# EAGLE design PlantSensorHead (EAGLE 8.0.2)
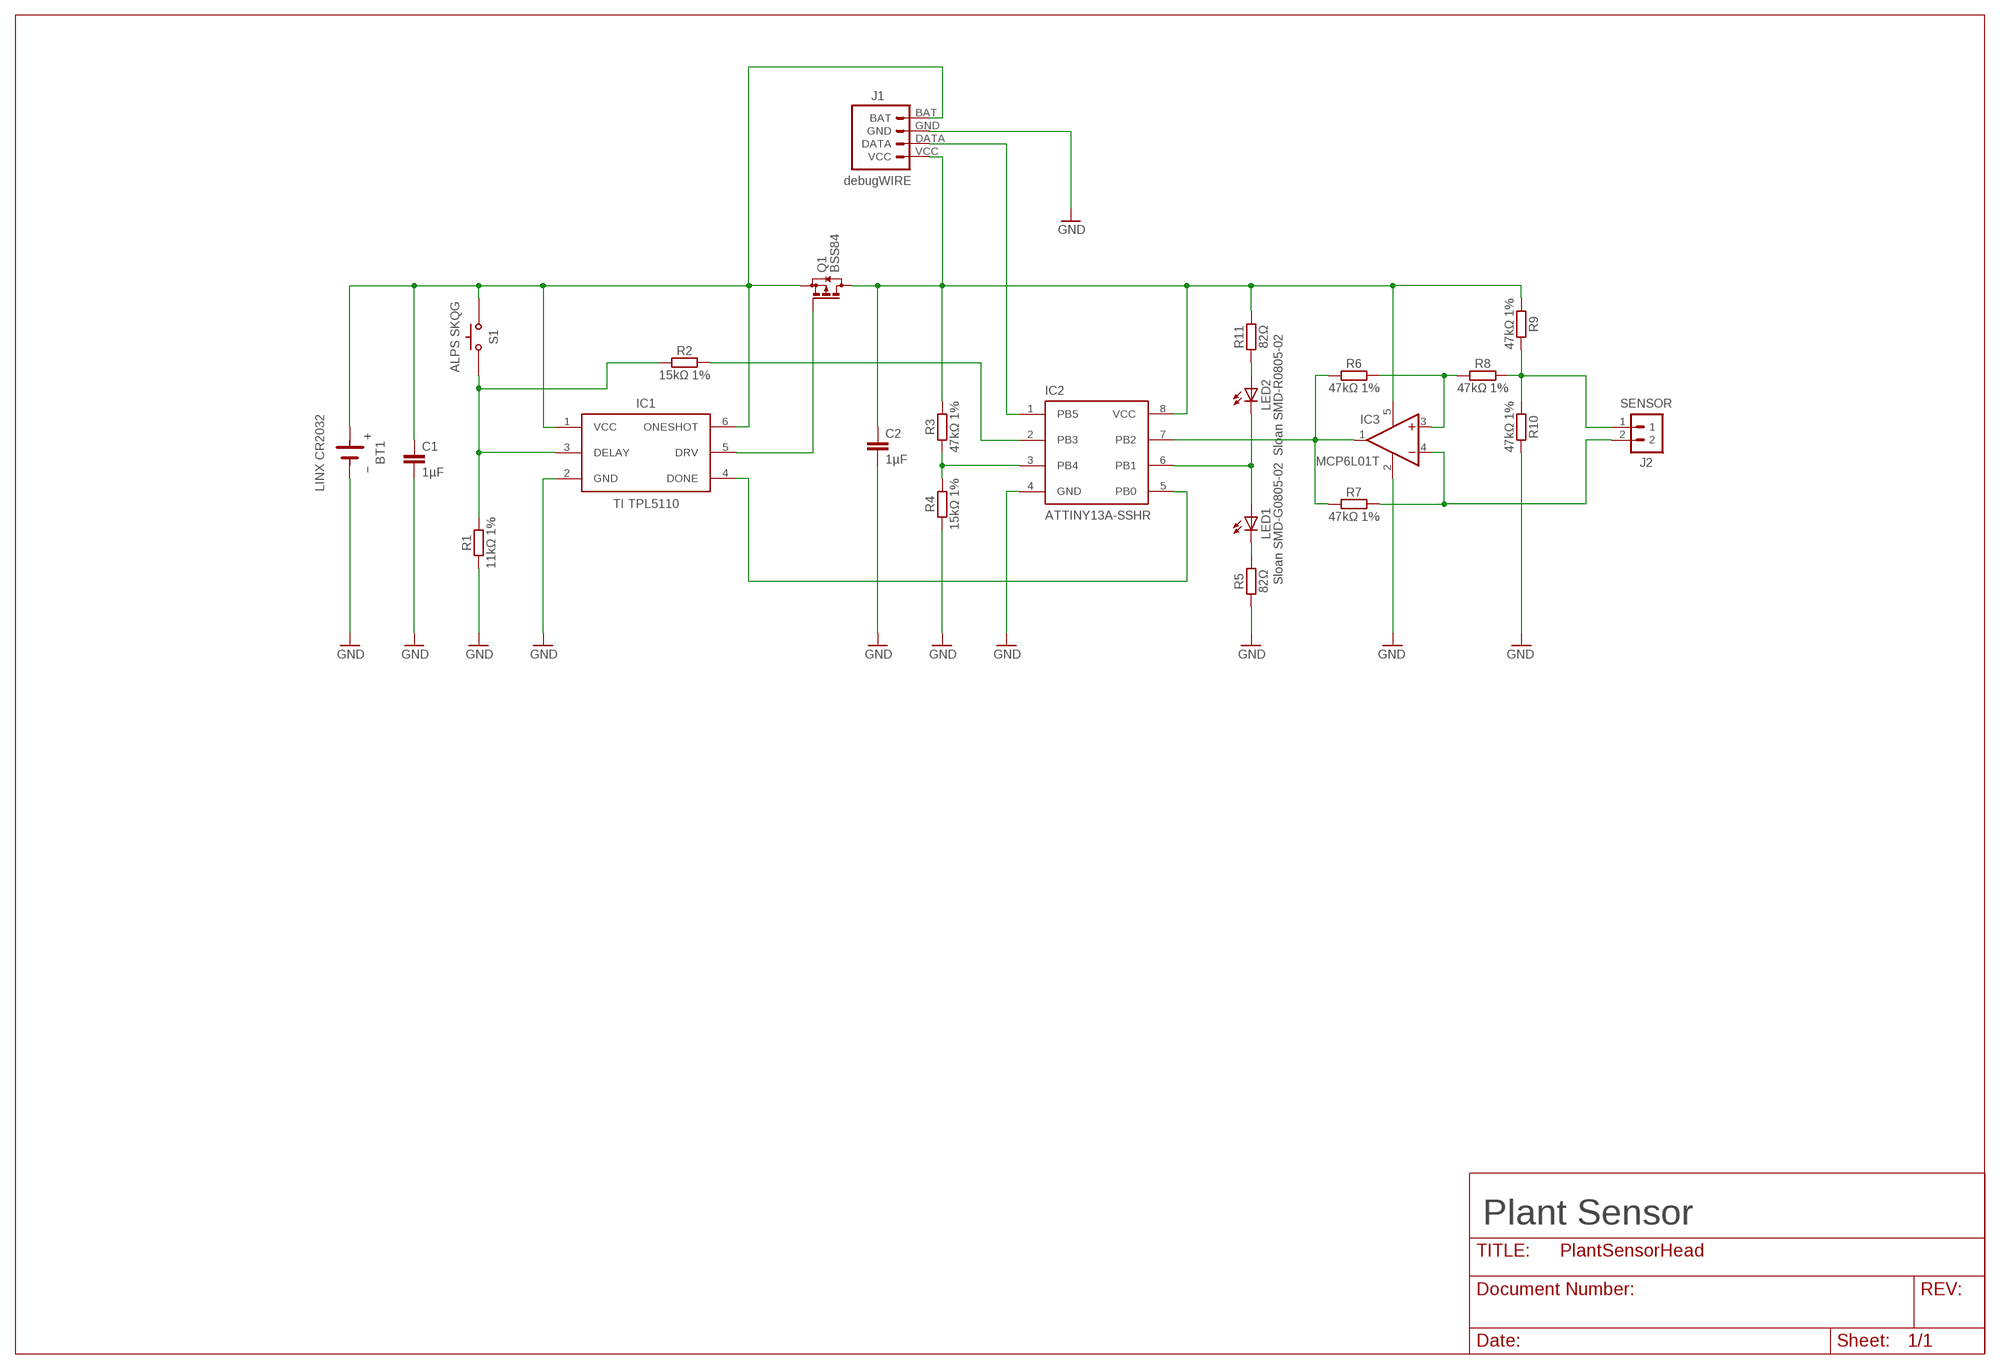
[diagram p0: schematic, sheet 1]

## Parts
BT1  LINX CR2032  LINX-CR2032-BATTERY-HOLDER  [LINX-BAT-HLD-001]
C1  1µF  C0805-MURATA-GRM-21  [CAPACITOR-0805-MURATA-GRM-21]
C2  1µF  C0805-MURATA-GRM-21  [CAPACITOR-0805-MURATA-GRM-21]
IC1  TI TPL5110  TPL5110SOT  [SOT23-6L]
IC2  ATTINY13A-SSHR  ATTINY13SO08  [SO08_015_JEDEC]
IC3  MCP6L01T  MCP601OT  [SOT23-5]
J1  debugWIRE  CON-DEBUGWIRE-SMD-50  [CON-PADS-DEBUG-WIRE-50]
J2  SENSOR  CON_2X1WIREPADS  [CON_PADS_2XWIRE]
LED1  Sloan SMD-G0805-02  LED0805-SLOAN  [LED-0805-SLOAN]
LED2  Sloan SMD-R0805-02  LED0805-SLOAN  [LED-0805-SLOAN]
Q1  BSS84  [SOT23]
R1  11kΩ 1%  RESISTOR0805-KOA-RK73-2A  [RESISTOR-0805-KOA-RK73-2A]
R2  15kΩ 1%  RESISTOR0805-KOA-RK73-2A  [RESISTOR-0805-KOA-RK73-2A]
R3  47kΩ 1%  RESISTOR0805-KOA-RK73-2A  [RESISTOR-0805-KOA-RK73-2A]
R4  15kΩ 1%  RESISTOR0805-KOA-RK73-2A  [RESISTOR-0805-KOA-RK73-2A]
R5  82Ω  RESISTOR0805-KOA-RK73-2A  [RESISTOR-0805-KOA-RK73-2A]
R6  47kΩ 1%  RESISTOR0805-KOA-RK73-2A  [RESISTOR-0805-KOA-RK73-2A]
R7  47kΩ 1%  RESISTOR0805-KOA-RK73-2A  [RESISTOR-0805-KOA-RK73-2A]
R8  47kΩ 1%  RESISTOR0805-KOA-RK73-2A  [RESISTOR-0805-KOA-RK73-2A]
R9  47kΩ 1%  RESISTOR0805-KOA-RK73-2A  [RESISTOR-0805-KOA-RK73-2A]
R10  47kΩ 1%  RESISTOR0805-KOA-RK73-2A  [RESISTOR-0805-KOA-RK73-2A]
R11  82Ω  RESISTOR0805-KOA-RK73-2A  [RESISTOR-0805-KOA-RK73-2A]
S1  ALPS SKQG  ALPS_SKQG_BUTTONAKE010  [ALPS_SKQGAKE010]

## Nets
BTN: IC1.3(DELAY) R1.2 R2.1 S1.1 S1.2
C_FREQ: IC2.7(PB2) IC3.1(OUT) R6.2 R7.2
DONE: IC1.4(DONE) IC2.5(PB0)
GND: BT1.GND C1.2 C2.2 IC1.2(GND) IC2.4(GND) IC3.2(V-) J1.GND R1.1 R4.1 R5.1 R10.1
LED: IC2.6(PB1) LED1.A LED2.C
N$1: LED2.A R11.1
N$2: LED1.C R5.2
N$3: IC1.5(DRV) Q1.1(G)
N$4: IC2.2(PB3) R2.2
N$10: IC3.3(+IN) R6.1 R8.2
RST: IC2.1(PB5) J1.DATA
SENS1A: J2.1 R8.1 R9.1 R10.2
SENS2A: IC3.4(-IN) J2.2 R7.1
VBR: IC2.3(PB4) R3.1 R4.2
VCCB: BT1.VDD1(VDD) BT1.VDD2(VDD) C1.1 IC1.1(VCC) IC1.6(ONESHOT) J1.BAT Q1.2(S) S1.3 S1.4
VCCM: C2.1 IC2.8(VCC) IC3.5(V+) J1.VCC Q1.3(D) R3.2 R9.2 R11.2

## Notes on the sheet
- Plant Sensor

## Library data of the parts
BT1 = lucky-resistor:LINX-CR2032-BATTERY-HOLDER
C1 C2 = lucky-resistor:C
IC1 = lucky-resistor:TPL5110
IC2 = lucky-resistor:ATTINY13
IC3 = linear:MCP601
J1 = lucky-resistor:CON-DEBUGWIRE
J2 = lucky-resistor:CON_2X1
LED1 LED2 = lucky-resistor:LED
Q1 = lucky-resistor:BSS84: P-CHANNEL MOS FET
R1-R11 = lucky-resistor:RESISTOR
S1 = lucky-resistor:ALPS_SKQG_BUTTON

## Net classes
0 default: clearance 0.205 mm

## Board
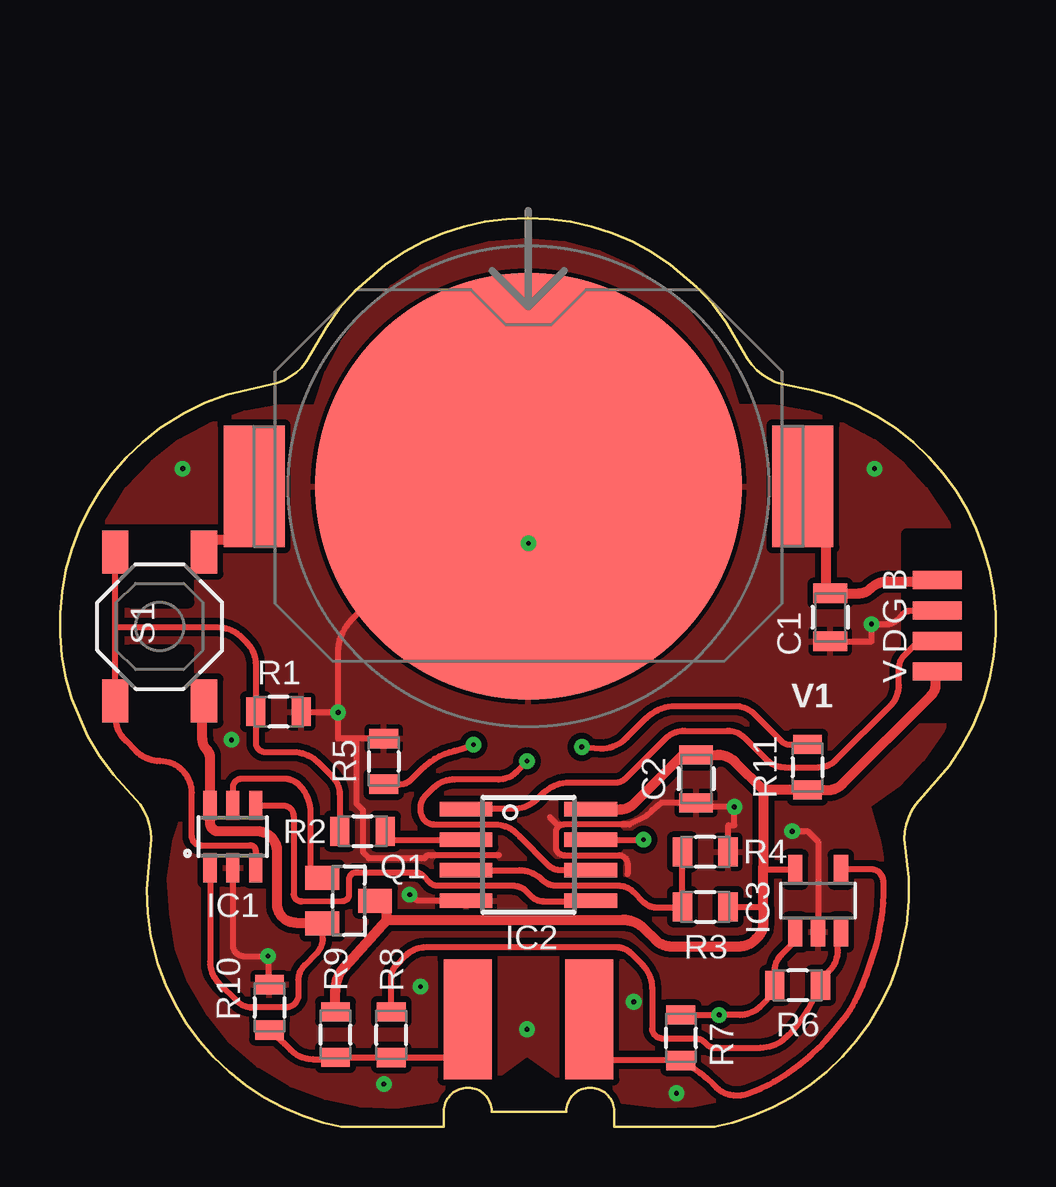
[diagram p1: board, top side]
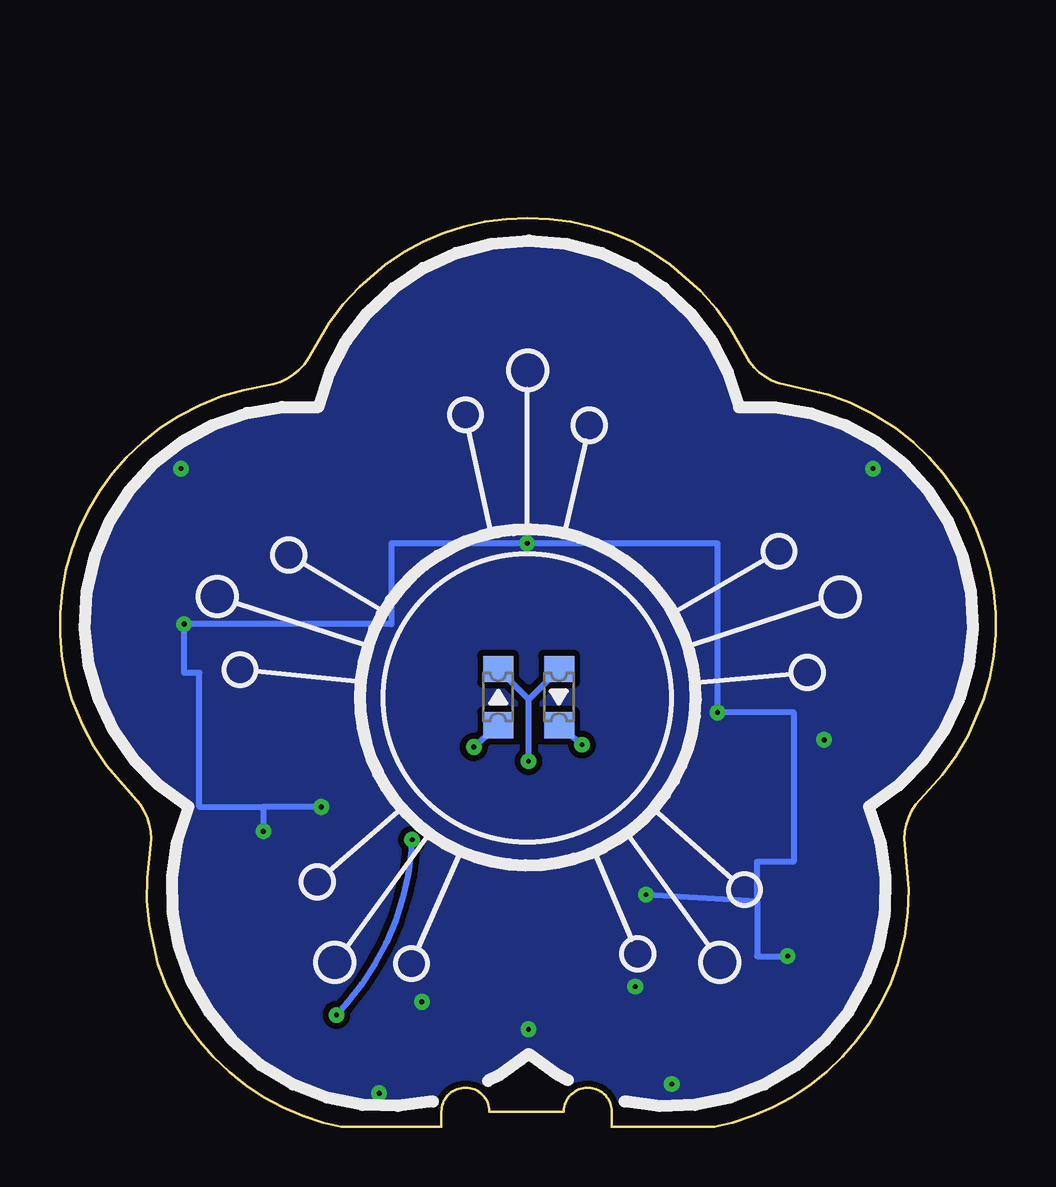
[diagram p2: board, bottom side, seen from below]

Size 38.98 x 37.88 mm. Coordinates in mm from the lower left corner, seen from the top.
Outline: 28.01,0.17 28.87,0.45 29.7,0.81 30.49,1.24 31.24,1.73 31.94,2.29 32.59,2.91 33.19,3.59 33.72,4.32 34.19,5.1 34.58,5.92 34.91,6.79 35.28,8.44 35.36,9.41 35.36,10.37 35.18,12.01 35.2,12.31 35.26,12.61 35.36,12.9 35.49,13.18 35.65,13.44 37.04,15.04 37.58,15.85 38.05,16.72 38.49,17.82 38.74,18.71 38.9,19.62 38.98,20.52 38.98,21.43 38.9,22.32 38.74,23.21 38.5,24.07 38.18,24.91 37.79,25.72 37.33,26.5 36.8,27.23 36.21,27.92 35.54,28.55 34.82,29.12 34.03,29.63 33.15,30.09 32.24,30.45 31.33,30.72 30.09,30.95 29.8,31.05 29.52,31.18 29.27,31.35 29.03,31.54 28.82,31.77 28.63,32.01 27.77,33.51 27.19,34.28 26.53,35.01 25.43,35.94 24.66,36.46 23.86,36.89 23.02,37.25 22.16,37.52 21.28,37.72 20.39,37.84 19.49,37.88 18.6,37.84 17.7,37.72 16.83,37.52 15.96,37.25 15.13,36.89 14.32,36.46 13.55,35.94 12.29,34.83 11.64,34.09 11.08,33.31 10.26,31.89 10.06,31.65 9.84,31.44 9.59,31.26 9.32,31.11 9.04,31 6.97,30.52 6.06,30.19 5.17,29.76 4.17,29.12 3.44,28.55 2.78,27.92 2.18,27.23 1.65,26.5 1.19,25.72 0.8,24.91 0.49,24.07 0.25,23.21 0.09,22.32 0,21.43 0,20.52 0.08,19.62 0.24,18.71 0.5,17.82 1.16,16.28 1.66,15.44 2.23,14.67 3.34,13.44 3.5,13.18 3.63,12.9 3.72,12.61 3.78,12.31 3.8,12.01 3.61,9.89 3.65,8.92 3.79,7.95 4.08,6.79 4.4,5.92 4.8,5.1 5.26,4.32 5.8,3.59 6.39,2.91 7.04,2.29 7.75,1.73 8.5,1.24 9.29,0.81 10.11,0.45 10.97,0.17 11.72,0 15.99,0 15.99,0.63
Outline: 17.99,0.63 arc0 17.99,0.63 arc0 17.99,0.63
Outline: 17.99,0.63 arc90 16.99,1.63
Outline: 16.99,1.63 arc90 15.99,0.63
Outline: 21.09,0.63 arc-90 22.09,1.63 arc-90 23.09,0.63 23.09,0 27.26,0 28.01,0.17
Outline: 21.09,0.63 arc0 21.09,0.63
Outline: 17.99,0.63 arc90 16.99,1.63
Outline: 16.99,1.63 arc90 15.99,0.63
Outline: 17.99,0.63 21.09,0.63
Copper layers (1*16): Top 0.018mm / dielectric 1.55mm / Bottom 0.018mm
Design rules "eC_2Layer_PClass5_BaseCopperO18 *": minimum track width 0.175mm, minimum drill 0.35mm, track to track 0.175mm, track to pad 0.175mm, pad to pad 0.175mm, via to via 0.175mm, smd to smd 0mil, copper to edge 0.25mm, drill to drill 0.35mm, minimum pad ring 0.2mm, minimum via ring 0.15mm, stop-mask expansion 0mil, vias tented up to drill 0.45mm, thermal gap 0.2mm

### Footprints (pad centres in the part's own frame; a part is rotated, then mirrored left to right if it is on the bottom)
LINX-BAT-HLD-001 = smd 17.78 x 17.78: GND 0,0 | smd 2.54 x 5.08: VDD1 -11.43,0; VDD2 11.43,0
CAPACITOR-0805-MURATA-GRM-21 = smd 0.8 x 1.4: 1 -1,0; 2 1,0
SOT23-6L = smd 0.55 x 1.2: 1 -0.95,-1.3; 2 0,-1.3; 3 0.95,-1.3; 4 0.95,1.3; 5 0,1.3; 6 -0.95,1.3
SO08_015_JEDEC = smd 2.2 x 0.6: 1 -2.6,1.905; 2 -2.6,0.635; 3 -2.6,-0.635; 4 -2.6,-1.905; 5 2.6,-1.905; 6 2.6,-0.635; 7 2.6,0.635; 8 2.6,1.905
SOT23-5 = smd 0.6 x 1.2: 1 -0.95,-1.306; 2 0,-1.306; 3 0.95,-1.306; 4 0.95,1.306; 5 -0.95,1.306
CON-PADS-DEBUG-WIRE-50 = smd 0.762 x 2.032: BAT 1.905,0; DATA -0.635,0; GND 0.635,0; VCC -1.905,0
CON_PADS_2XWIRE = smd 2 x 5: 1 -2.54,0; 2 2.54,0
LED-0805-SLOAN = smd 1.1 x 1.25: A -1.175,0; C 1.175,0
SOT23 = smd 1 x 1.4: 1 -0.95,-1.1; 2 0.95,-1.1; 3 0,1.1
RESISTOR-0805-KOA-RK73-2A = smd 0.8 x 1.2: 1 -0.95,0; 2 0.95,0
ALPS_SKQGAKE010 = smd 1.8 x 1.1: 1 -3.1,1.85; 2 3.1,1.85; 3 -3.1,-1.85; 4 3.1,-1.85

### Placement (x,y rotation side)
BT1  19.52,26.7 180 top
C1  32.09,21.24 270 top
C2  26.51,14.51 270 top
IC1  7.2,12.09 0 top
IC2  19.52,11.33 0 top
IC3  31.59,9.43 0 top
J1  36.55,20.89 90 top
J2  19.52,4.47 0 top
LED1  18.19,17.91 270 bottom
LED2  20.73,17.91 90 bottom
Q1  12.03,9.43 270 top
R1  9.11,17.3 180 top
R2  12.6,12.32 0 top
R3  26.89,9.17 0 top
R4  26.89,11.46 180 top
R5  13.49,15.23 270 top
R6  30.74,5.9 180 top
R7  25.87,3.71 90 top
R8  13.81,3.84 90 top
R9  11.48,3.85 90 top
R10  8.73,4.98 270 top
R11  31.15,14.99 270 top
S1  4.15,20.86 90 top

### Tracks (layer width: path | path; a pad name or v marks a point on that pad's centre or on a via)
BTN
  Top 0.254: 2.3,20.83 S1.2 | 2.3,20.83 S1.1 2.32,17.74 2.32,17.09 arc45 2.73,16.1 3.17,15.65 arc45 4.17,15.24 arc-90 5.49,13.92 5.49,12.11 arc90 5.87,11.73 7.92,11.73 arc-90 8.15,11.51 IC1.3 8.15,11.31 | 2.3,20.83 6.56,20.83 arc-45 7.56,20.41 7.75,20.23 arc-45 8.16,19.23 R1.2 8.16,16.01 arc90 8.54,15.62 9.73,15.62 arc-45 10.73,15.21 11.36,14.58 arc-45 11.65,13.86 R2.1
C_FREQ  (via drill 0.2 pad 0.65)
  Top 0.254: 23.08,11.97 IC2.7 v24.31,11.97 | IC3.1 30.51,7.62 30.05,7.16 arc45 29.79,6.52 R6.2 29.79,5.63 29.17,5.01 arc-45 28.33,4.66 v27.46,4.66 R7.2
  Bottom 0.254: v24.31,11.97 24.35,11.54 arc36 27.04,5.15 v27.46,4.66
DONE
  Top 0.24: 15.72,10.05 18.88,10.05
  Top 0.254: IC1.4 9.29,13.39 arc-90 9.74,12.95 9.74,9.71 arc90 10.04,9.4 10.09,9.4 11.75,9.41 11.78,9.41 arc90 12.05,9.68 12.05,9.78 12.05,10 | 12.05,10 12.05,10.24 | 15.72,10.05 arc-45 15.41,10.19 15.13,10.47 arc45 14.82,10.6 12.41,10.61 12.35,10.61 arc90 12.05,10.3 12.05,10 | 18.88,10.05 arc-45 19.4,9.84 19.62,9.62 arc45 20.16,9.4 22.09,9.4 IC2.5
GND  (via drill 0.2 pad 0.65)
  Top 0.24: 23.73,12.6 20.98,12.6 | 20.98,12.6 arc90 20.66,12.27 20.66,11.64 arc90 21.02,11.32 23.29,11.32 arc-90 23.65,10.93 | 20.98,12.6 20.72,12.59 20.41,12.9 | 15.33,11.32 18.3,11.32
  Top 0.254: IC2.4 15.01,9.42 arc-46 14.69,9.56 v14.57,9.68 | 8.67,5.99 8.53,6.12 | 26.7,13.34 v28.1,13.34 28.1,12.57 27.84,12.57 R4.1 27.84,11.94 28.1,11.94 | IC3.2 31.59,11.87 31.15,12.32 v30.51,12.32 | 8.67,5.99 v8.67,7.11 7.65,7.11 arc-90 7.2,7.56 | 8.67,5.99 R10.1 | J1.GND 35.5,21.52 arc45 35.1,21.36 34.86,21.11 arc-45 34.48,20.95 v33.81,20.95 33.81,20.24 C1.2 | v11.59,17.27 10.06,17.27 R1.1 | v11.59,17.27 11.59,19.75 arc-45 12.17,21.16 17.68,26.67 | IC1.2 7.2,7.56 | C2.2 25.06,13.51 24.68,13.19 24.41,12.94 23.73,12.6 | 23.65,10.93 23.65,10.54 | R5.1 11.59,16.18 v11.59,17.27 | 11.78,16.18 12.35,16.18 12.35,13.47 12.62,13.2 12.62,11.44 12.86,11.2 15.21,11.2 15.33,11.32
  Top 0.457: 26.7,13.34 C2.2
  Bottom 0.254: 9.94,9.43 9.94,11.05 8.41,11.05 8.41,17.27 v11.59,17.27 11.59,24.32 v19.52,24.32 25.18,24.32 25.18,20.95 v33.81,20.95 33.81,18.92 33.18,18.92 33.18,13.34 30.51,13.34 | 9.94,9.43 9.94,7.11 v8.67,7.11 | v14.57,9.68 9.94,9.43 | 30.51,13.34 v30.51,12.32 | 30.51,13.34 v28.1,13.34 28.23,13.34
  other vias: 15.02,5.84 13.49,1.78 19.46,4.06 23.91,5.21 25.69,1.4 7.14,16.13 5.11,27.43 33.94,27.43
  pour Bottom (isolate 0.254, no thermals): 4.99,28.55 6.27,29.24 7.73,29.75 9.14,29.99 10.67,30 11.16,31.45 11.82,32.72 12.74,33.93 13.84,34.98 15.06,35.82 16.41,36.41 17.91,36.81 19.42,36.93 20.98,36.81 22.46,36.42 23.86,35.79 25.04,34.96 26.12,33.97 27.07,32.75 27.75,31.43 28.2,30.04 29.75,29.99 31.18,29.75 32.62,29.24 33.92,28.54 35.1,27.6 36.06,26.54 36.9,25.26 37.52,23.81 37.89,22.26 37.96,20.78 37.77,19.25 37.38,17.87 36.75,16.54 35.93,15.35 34.92,14.27 33.66,13.37 34.09,11.85 34.32,10.43 34.29,8.9 34,7.43 33.5,6.07 32.79,4.8 31.81,3.62 30.7,2.62 29.31,1.8 27.9,1.23 26.38,0.92 25.01,0.87 23.44,1.06 21.99,1.49 20.73,2.13 19.45,3.03 18.19,2.13 16.9,1.5 15.48,1.08 14.01,0.86 12.55,0.91 11.09,1.22 9.64,1.76 8.27,2.58 7.12,3.58 6.19,4.74 5.43,6.05 4.91,7.43 4.67,8.9 4.58,10.32 4.81,11.88 5.29,13.33 4.11,14.18 3.03,15.25 2.2,16.47 1.56,17.81 1.11,19.25 0.95,20.75 1.01,22.25 1.37,23.83 2,25.25 2.81,26.56 3.88,27.68
  pour Top (isolate 0.254): 4.99,28.55 6.27,29.24 7.73,29.75 9.14,29.99 10.67,30 11.16,31.45 11.82,32.72 12.74,33.93 13.84,34.98 15.06,35.82 16.41,36.41 17.91,36.81 19.42,36.93 20.98,36.81 22.46,36.42 23.86,35.79 25.04,34.96 26.12,33.97 27.07,32.75 27.75,31.43 28.2,30.04 29.75,29.99 31.18,29.75 32.62,29.24 33.92,28.54 35.1,27.6 36.06,26.54 36.9,25.26 37.52,23.81 37.89,22.26 37.96,20.78 37.77,19.25 37.38,17.87 36.75,16.54 35.93,15.35 34.92,14.27 33.66,13.37 34.09,11.85 34.32,10.43 34.29,8.9 34,7.43 33.5,6.07 32.79,4.8 31.81,3.62 30.7,2.62 29.31,1.8 27.9,1.23 26.38,0.92 25.01,0.87 23.44,1.06 21.99,1.49 20.73,2.13 19.45,3.03 18.19,2.13 16.9,1.5 15.48,1.08 14.01,0.86 12.55,0.91 11.09,1.22 9.64,1.76 8.27,2.58 7.12,3.58 6.19,4.74 5.43,6.05 4.91,7.43 4.67,8.9 4.58,10.32 4.81,11.88 5.29,13.33 4.11,14.18 3.03,15.25 2.2,16.47 1.56,17.81 1.11,19.25 0.95,20.75 1.01,22.25 1.37,23.83 2,25.25 2.81,26.56 3.88,27.68
LED  (via drill 0.2 pad 0.65)
  Top 0.254: v19.46,15.24 19.02,14.79 arc-45 18.27,14.48 16.45,14.48 arc45 15.52,14.1 15.23,13.8 arc45 15.02,13.29 15.02,13.21 arc45 15.2,12.77 arc45 15.6,12.6 17.24,12.6 18.14,12.6 arc-44 18.99,12.26 19.17,12.08 20.32,10.92 arc45 20.86,10.7 IC2.6
  Bottom 0.254: v19.46,15.24 19.46,17.81 | 19.46,17.81 LED2.C | 19.46,17.81 LED1.A
N$1  (via drill 0.2 pad 0.65)
  Top 0.254: v21.74,15.83 22.51,15.76 arc45 23.62,16.22 24.43,17.03 arc-45 25.65,17.54 28.11,17.54 arc-45 28.94,17.2 30.07,16.07 arc45 30.4,15.93 R11.1
  Bottom 0.254: LED2.A v21.74,15.83
N$2  (via drill 0.2 pad 0.65)
  Top 0.254: R5.2 14.17,14.28 arc45 14.63,14.47 15.08,14.92 arc-32 16.44,15.67 v17.23,15.92
  Bottom 0.254: LED1.C v17.23,15.92
N$3
  Top 0.254: IC1.5 7.2,14.14 arc-90 7.57,14.51 9.32,14.51 arc-48 10.02,14.2 arc-42 10.45,13.07 10.45,10.67 Q1.1
N$4
  Top 0.254: R2.2 13.91,11.97 IC2.2
N$10
  Top 0.254: R8.2 13.81,6.22 arc-45 14.03,6.76 14.41,7.14 arc-45 15.26,7.49 23.17,7.49 arc-45 23.78,7.24 24.25,6.77 arc-45 24.67,5.76 24.67,4.1 arc45 24.78,3.82 arc45 25.12,3.68 26.47,3.68 arc-45 26.87,3.52 26.98,3.4 arc45 27.22,3.3 29.19,3.3 arc48 30.34,3.81 30.55,4.05 arc15 31.34,5.2 R6.1 31.69,6.13 32.06,6.5 arc45 32.42,7.36 32.42,8.11 IC3.3
RST
  Top 0.254: IC2.1 16.89,13.27 18.91,13.27 arc44 19.86,13.65 20.17,13.93 arc-44 21.21,14.35 23.14,14.35 arc45 23.58,14.53 25.22,16.18 arc-45 26.03,16.51 27.82,16.51 arc-45 28.51,16.22 29.43,15.3 arc45 30.2,14.99 31.59,14.99 arc45 32.35,15.3 34.6,17.55 arc45 34.96,18.42 34.96,19.09 arc-45 35.2,19.67 35.72,20.19 36.5,20.19 J1.DATA
SENS1A
  Top 0.254: R9.1 11.2,2.95 | R9.1 R8.1 16.79,2.89 16.85,2.82 16.85,4.22 J2.1 | R10.2 9.36,3.46 9.61,3.21 arc45 10.54,2.82 11.2,2.82 R9.1
SENS2A
  Top 0.254: J2.2 22.09,4.35 22.09,2.78 25.24,2.78 R7.1 26.09,2.64 arc-15 27.2,1.78 27.36,1.62 arc36 27.91,1.34 28.06,1.32 arc30 28.63,1.38 28.94,1.49 arc10 29.76,1.88 29.88,1.95 arc11 31.24,2.94 31.32,3.01 arc9 32.18,3.91 32.64,4.48 arc13 33.12,5.22 33.21,5.39 arc9 33.79,6.85 33.95,7.35 arc7 34.14,8.16 34.22,8.61 arc10 34.32,9.69 34.32,10.15 arc45 34.14,10.6 arc45 33.82,10.73 IC3.4
VBR
  Top 0.24: 20.07,10.31 arc45 20.7,10.05 23.25,10.05 arc-45 23.9,9.78
  Top 0.254: 25.94,11.84 R4.2 R3.1 25.91,9.14 24.87,9.14 arc-45 24.31,9.38 23.9,9.78 | IC2.3 19.14,10.7 arc-45 20.07,10.31
VCCB
  Top 0.254: 5.93,17.68 S1.3 | 10.87,8.54 Q1.2 10.95,8.45 10.95,7.84 arc-45 10.71,7.25 10.19,6.73 arc45 9.94,6.11 9.94,5.51 arc-90 9.4,4.97 7.99,4.97 arc-45 7.38,5.23 6.62,5.98 arc-45 6.25,6.88 IC1.1 | S1.4 5.99,23.96 5.99,24.48 | 8.09,24.48 BT1.VDD2
  Top 0.406: 5.93,17.68 5.93,16.16 arc45 6.11,15.72 arc-45 6.25,15.39 IC1.6 6.25,12.67 arc90 6.6,12.32 8.2,12.32 arc-90 9.05,11.47 9.05,9.28 arc90 9.82,8.51 10.83,8.51 Q1.2 | 5.99,24.48 8.09,24.48 | 31.91,24.38 31.91,22.37 | C1.1 33.29,22.24 arc45 33.77,22.44 arc-45 34.48,22.73 36.5,22.73
  Top 0.457: BT1.VDD1 30.95,25.34 31.91,24.38 | 31.91,22.37 C1.1 | 36.5,22.73 J1.BAT
VCCM
  Top 0.254: 13.17,9.47 Q1.3 13.17,9.38 | 29.3,10.82 29.39,10.73 IC3.5 | R3.2 29.3,9.17
  Top 0.406: R9.2 11.48,5.66 arc-42 11.86,6.67 13.61,8.63 | 13.61,8.63 13.61,9.38 13.17,9.38 | 13.61,8.63 23.45,8.63 arc-45 24.32,8.28 24.82,7.78 arc45 25.45,7.52 28.31,7.52 arc45 28.96,7.79 29.07,7.9 arc45 29.3,8.46 29.3,9.17 29.3,10.82 29.3,14.04 | IC2.8 23.38,13.24 arc45 23.9,13.45 25.94,15.49 26.49,15.49 C2.1 27.42,15.51 arc-45 28.12,15.21 29.3,14.04 | 36.48,18.91 36.48,18.42 arc-45 36.3,17.98 32.6,14.28 arc-45 32,14.04 R11.2 29.3,14.04 | 29.3,14.04
  Top 0.457: 36.48,18.91 J1.VCC

### Text on the board
tPlace: V1